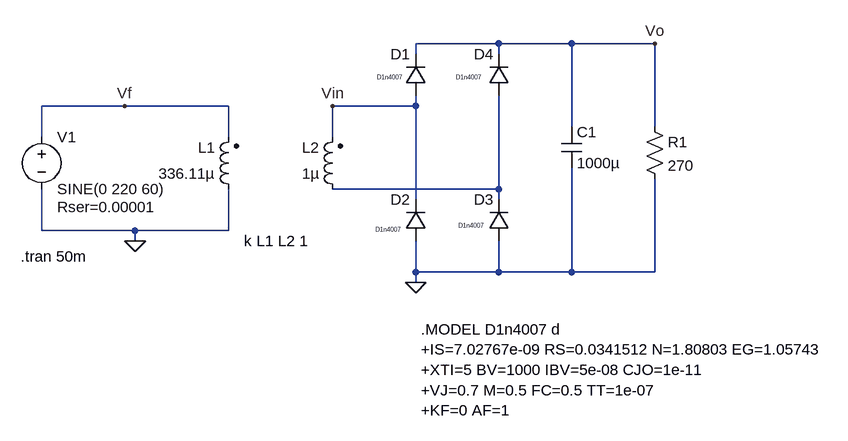
[diagram p0: schematic Ondacompleta_capacitor 1000u.asc]
Ondacompleta_capacitor 1000u.asc, the LTspice schematic file:
Version 4
SHEET 1 1676 680
WIRE 752 -16 624 -16
WIRE 864 -16 752 -16
WIRE 992 -16 864 -16
WIRE 624 0 624 -16
WIRE 752 0 752 -16
WIRE 176 80 48 80
WIRE 336 80 176 80
WIRE 624 80 624 64
WIRE 624 80 496 80
WIRE 864 112 864 -16
WIRE 992 112 992 -16
WIRE 48 128 48 80
WIRE 336 128 336 80
WIRE 496 128 496 80
WIRE 752 208 752 64
WIRE 752 208 496 208
WIRE 624 224 624 80
WIRE 752 224 752 208
WIRE 48 272 48 208
WIRE 192 272 48 272
WIRE 336 272 336 208
WIRE 336 272 192 272
WIRE 192 288 192 272
WIRE 624 336 624 288
WIRE 752 336 752 288
WIRE 752 336 624 336
WIRE 864 336 864 176
WIRE 864 336 752 336
WIRE 992 336 992 192
WIRE 992 336 864 336
WIRE 624 352 624 336
FLAG 192 288 0
FLAG 624 352 0
FLAG 176 80 Vf
FLAG 496 80 Vin
FLAG 992 -16 Vo
SYMBOL voltage 48 112 R0
WINDOW 123 0 0 Left 0
WINDOW 39 24 124 Left 2
SYMATTR SpiceLine Rser=0.00001
SYMATTR InstName V1
SYMATTR Value SINE(0 220 60)
SYMBOL ind2 352 224 R180
WINDOW 0 36 80 Left 2
WINDOW 3 36 40 Left 2
SYMATTR InstName L1
SYMATTR Value 336.11µ
SYMATTR Type ind
SYMBOL ind2 512 224 R180
WINDOW 0 36 80 Left 2
WINDOW 3 36 40 Left 2
SYMATTR InstName L2
SYMATTR Value 1µ
SYMATTR Type ind
SYMBOL res 976 96 R0
SYMATTR InstName R1
SYMATTR Value 270
SYMBOL diode 640 288 R180
WINDOW 0 24 64 Left 2
WINDOW 3 37 18 Left 0
SYMATTR InstName D2
SYMATTR Value D1n4007
SYMBOL diode 768 288 R180
WINDOW 0 24 64 Left 2
WINDOW 3 37 24 Left 0
SYMATTR InstName D3
SYMATTR Value D1n4007
SYMBOL diode 768 64 R180
WINDOW 0 24 64 Left 2
WINDOW 3 41 28 Left 0
SYMATTR InstName D4
SYMATTR Value D1n4007
SYMBOL diode 640 64 R180
WINDOW 0 24 64 Left 2
WINDOW 3 35 28 Left 0
SYMATTR InstName D1
SYMATTR Value D1n4007
SYMBOL cap 848 112 R0
SYMATTR InstName C1
SYMATTR Value 1000µ
TEXT 360 288 Left 2 !k L1 L2 1
TEXT 16 312 Left 2 !.tran 50m
TEXT 632 424 Left 2 !.MODEL D1n4007 d\n+IS=7.02767e-09 RS=0.0341512 N=1.80803 EG=1.05743\n+XTI=5 BV=1000 IBV=5e-08 CJO=1e-11\n+VJ=0.7 M=0.5 FC=0.5 TT=1e-07\n+KF=0 AF=1

The netlist it stands for:
* Ondacompleta_capacitor 1000u.asc
V1 Vf 0 SINE(0 220 60) Rser=0.00001
L1 0 Vf 336.11µ
L2 N001 Vin 1µ
R1 Vo 0 270
D2 0 Vin D1n4007
D3 0 N001 D1n4007
D4 N001 Vo D1n4007
D1 Vin Vo D1n4007
C1 Vo 0 1000µ
.model D D
.lib standard.dio
k L1 L2 1
.tran 50m
.MODEL D1n4007 d
+IS=7.02767e-09 RS=0.0341512 N=1.80803 EG=1.05743
+XTI=5 BV=1000 IBV=5e-08 CJO=1e-11
+VJ=0.7 M=0.5 FC=0.5 TT=1e-07
+KF=0 AF=1
.backanno
.end